# Altium schematic sheet [01] - Edge-connections.SchDoc: EE-02 - Edge connections
size A4; DocumentNumber: 2; SheetNumber: 2; SheetTotal: 5
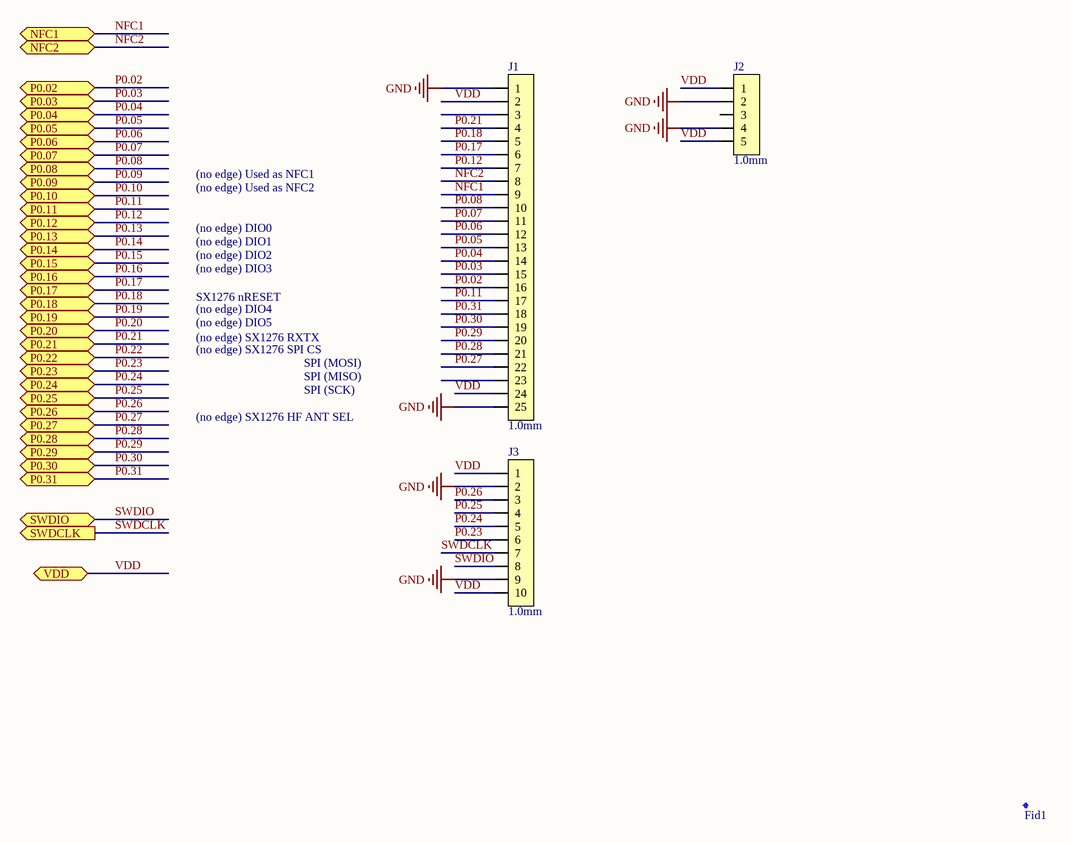
[diagram p0: [01] - Edge-connections.SchDoc]

## Parts
Fid1  Fiducial mark  [Fiducial]  (value not drawn)
J1  1.0mm  [EDGE_MULTI_25]  (no BOM)
J2  1.0mm  [EDGE_MULTI_5]  (no BOM)
J3  1.0mm  [EDGE_MULTI_10]  (no BOM)
LOGO1  TELENOR_LOGO  [TELENOR_4mmx3.8mm]  (value not drawn)

## Ports
NFC1 (bidir), NFC2 (bidir), P0.02 (bidir), P0.03 (bidir), P0.04 (bidir), P0.05 (bidir), P0.06 (bidir), P0.07 (bidir), P0.08 (bidir), P0.09 (bidir), P0.10 (bidir), P0.11 (bidir), P0.12 (bidir), P0.13 (bidir), P0.14 (bidir), P0.15 (bidir), P0.16 (bidir), P0.17 (bidir), P0.18 (bidir), P0.19 (bidir), P0.20 (bidir), P0.21 (bidir), P0.22 (bidir), P0.23 (bidir), P0.24 (bidir), P0.25 (bidir), P0.26 (bidir), P0.27 (bidir), P0.28 (bidir), P0.29 (bidir), P0.30 (bidir), P0.31 (bidir), SWDCLK (out), SWDIO (bidir), VDD

## Nets
GND: J1.1 J1.25 J2.2 J2.4 J3.2 J3.9
NFC1: J1.9 ; port NFC1
NFC2: J1.8 ; port NFC2
P0.02: J1.16 ; port P0.02
P0.03: J1.15 ; port P0.03
P0.04: J1.14 ; port P0.04
P0.05: J1.13 ; port P0.05
P0.06: J1.12 ; port P0.06
P0.07: J1.11 ; port P0.07
P0.08: J1.10 ; port P0.08
P0.09: port P0.09
P0.10: port P0.10
P0.11: J1.17 ; port P0.11
P0.12: J1.7 ; port P0.12
P0.13: port P0.13
P0.14: port P0.14
P0.15: port P0.15
P0.16: port P0.16
P0.17: J1.6 ; port P0.17
P0.18: J1.5 ; port P0.18
P0.19: port P0.19
P0.20: port P0.20
P0.21: J1.4 ; port P0.21
P0.22: port P0.22
P0.23: J3.6 ; port P0.23
P0.24: J3.5 ; port P0.24
P0.25: J3.4 ; port P0.25
P0.26: J3.3 ; port P0.26
P0.27: J1.22 ; port P0.27
P0.28: J1.21 ; port P0.28
P0.29: J1.20 ; port P0.29
P0.30: J1.19 ; port P0.30
P0.31: J1.18 ; port P0.31
SWDCLK: J3.7 ; port SWDCLK
SWDIO: J3.8 ; port SWDIO
VDD: J1.2 J1.24 J2.1 J2.5 J3.1 J3.10 ; port VDD

Not connected (* = marked no-connect by the designer): J1 3 23; J2 3

## Notes on the sheet
- (no edge) Used as NFC1
- (no edge) DIO0
- (no edge) DIO1
- (no edge) Used as NFC2
- (no edge) DIO2
- (no edge) DIO3
- (no edge) DIO4
- SX1276 nRESET
- (no edge) DIO5
- (no edge) SX1276 SPI CS
- (no edge) SX1276 RXTX
- SPI (MOSI)
- SPI (MISO)
- (no edge) SX1276 HF ANT SEL
- SPI (SCK)
- Title
- Size:
- Date:
- A4
- Number:
- Time:
- Revision:
- Sheet
- of
- File:

## Library data of the parts
Fid1 = Fiducial: Part Number: Fid-Mark; Artikkelnr Noca: N.A.; Manufacturer: *; Manufacturer Part Number: *; Datasheet: *; LatestRevisionDate: 2009-12-12; Pin Count: 1; Publisher: Nordic Semiconductor; Published: 2009-12-12; Value: *; Note: *; Supplier: *; Supplier part number: *; 2nd source Supplier: *; 2nd source part number: *; Footprint Doc: Fiducial; Artikkelnr Simpro: N.A.
J1 = EDGE_MULTI_25_P_1mm: Edge Connector, 25 pins, 1mm pitch; Pitch: 1.0mm; Pins: 25
J2 = EDGE_MULTI_5_P_1mm: Edge Connector, 5 pins, 1mm pitch; Pitch: 1.0mm; Pins: 5
J3 = EDGE_MULTI_10_P_1mm: Edge Connector, 10 pins, 1mm pitch; Pitch: 1.0mm; Pins: 10